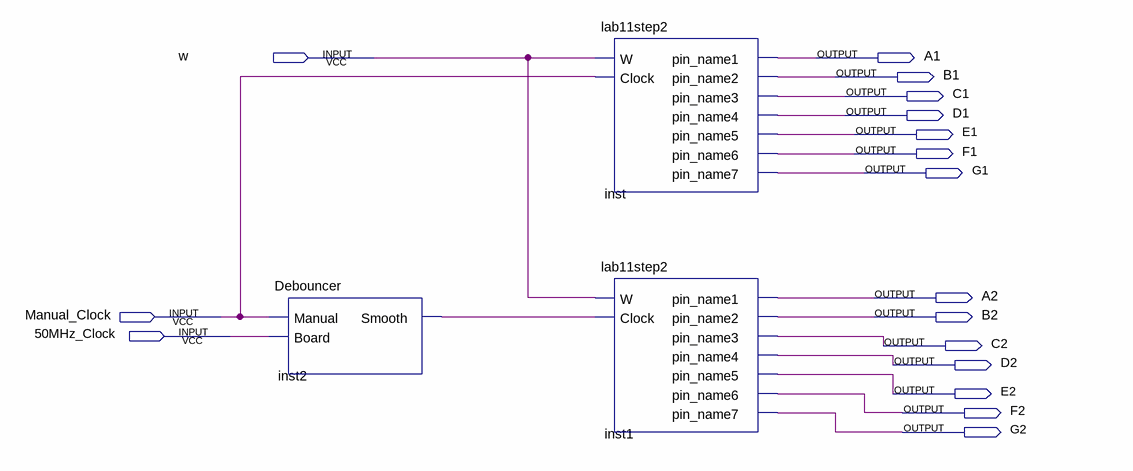
[diagram p0: schematic sheet]
// Quartus schematic lab11step3.bdf as structural Verilog: 3 symbols, 17 pins
module lab11step3 (
  input  w,
  input  Manual_Clock,
  input  \50MHz_Clock ,
  output A1,
  output B1,
  output C1,
  output D1,
  output E1,
  output F1,
  output G1,
  output A2,
  output B2,
  output C2,
  output D2,
  output E2,
  output F2,
  output G2
);

  wire inst2_smooth;

  Debouncer inst2 (.Manual(Manual_Clock), .Board(\50MHz_Clock ), .Smooth(inst2_smooth));
  lab11step2 inst (
    .W(w), .Clock(Manual_Clock), .pin_name1(A1), .pin_name2(B1), .pin_name3(C1), .pin_name4(D1),
    .pin_name5(E1), .pin_name6(F1), .pin_name7(G1));
  lab11step2 inst1 (
    .W(w), .Clock(inst2_smooth), .pin_name1(A2), .pin_name2(B2), .pin_name3(C2), .pin_name4(D2),
    .pin_name5(E2), .pin_name6(F2), .pin_name7(G2));
endmodule
